# Altium schematic sheet TI_92_adc.SchDoc: Data_Input
size B; Organization: Altium Limited; Address1: L3, 12a Rodborough Rd; Address2: Frenchs Forest; Address3: NSW; Address4: Australia 2086; SheetNumber: 3
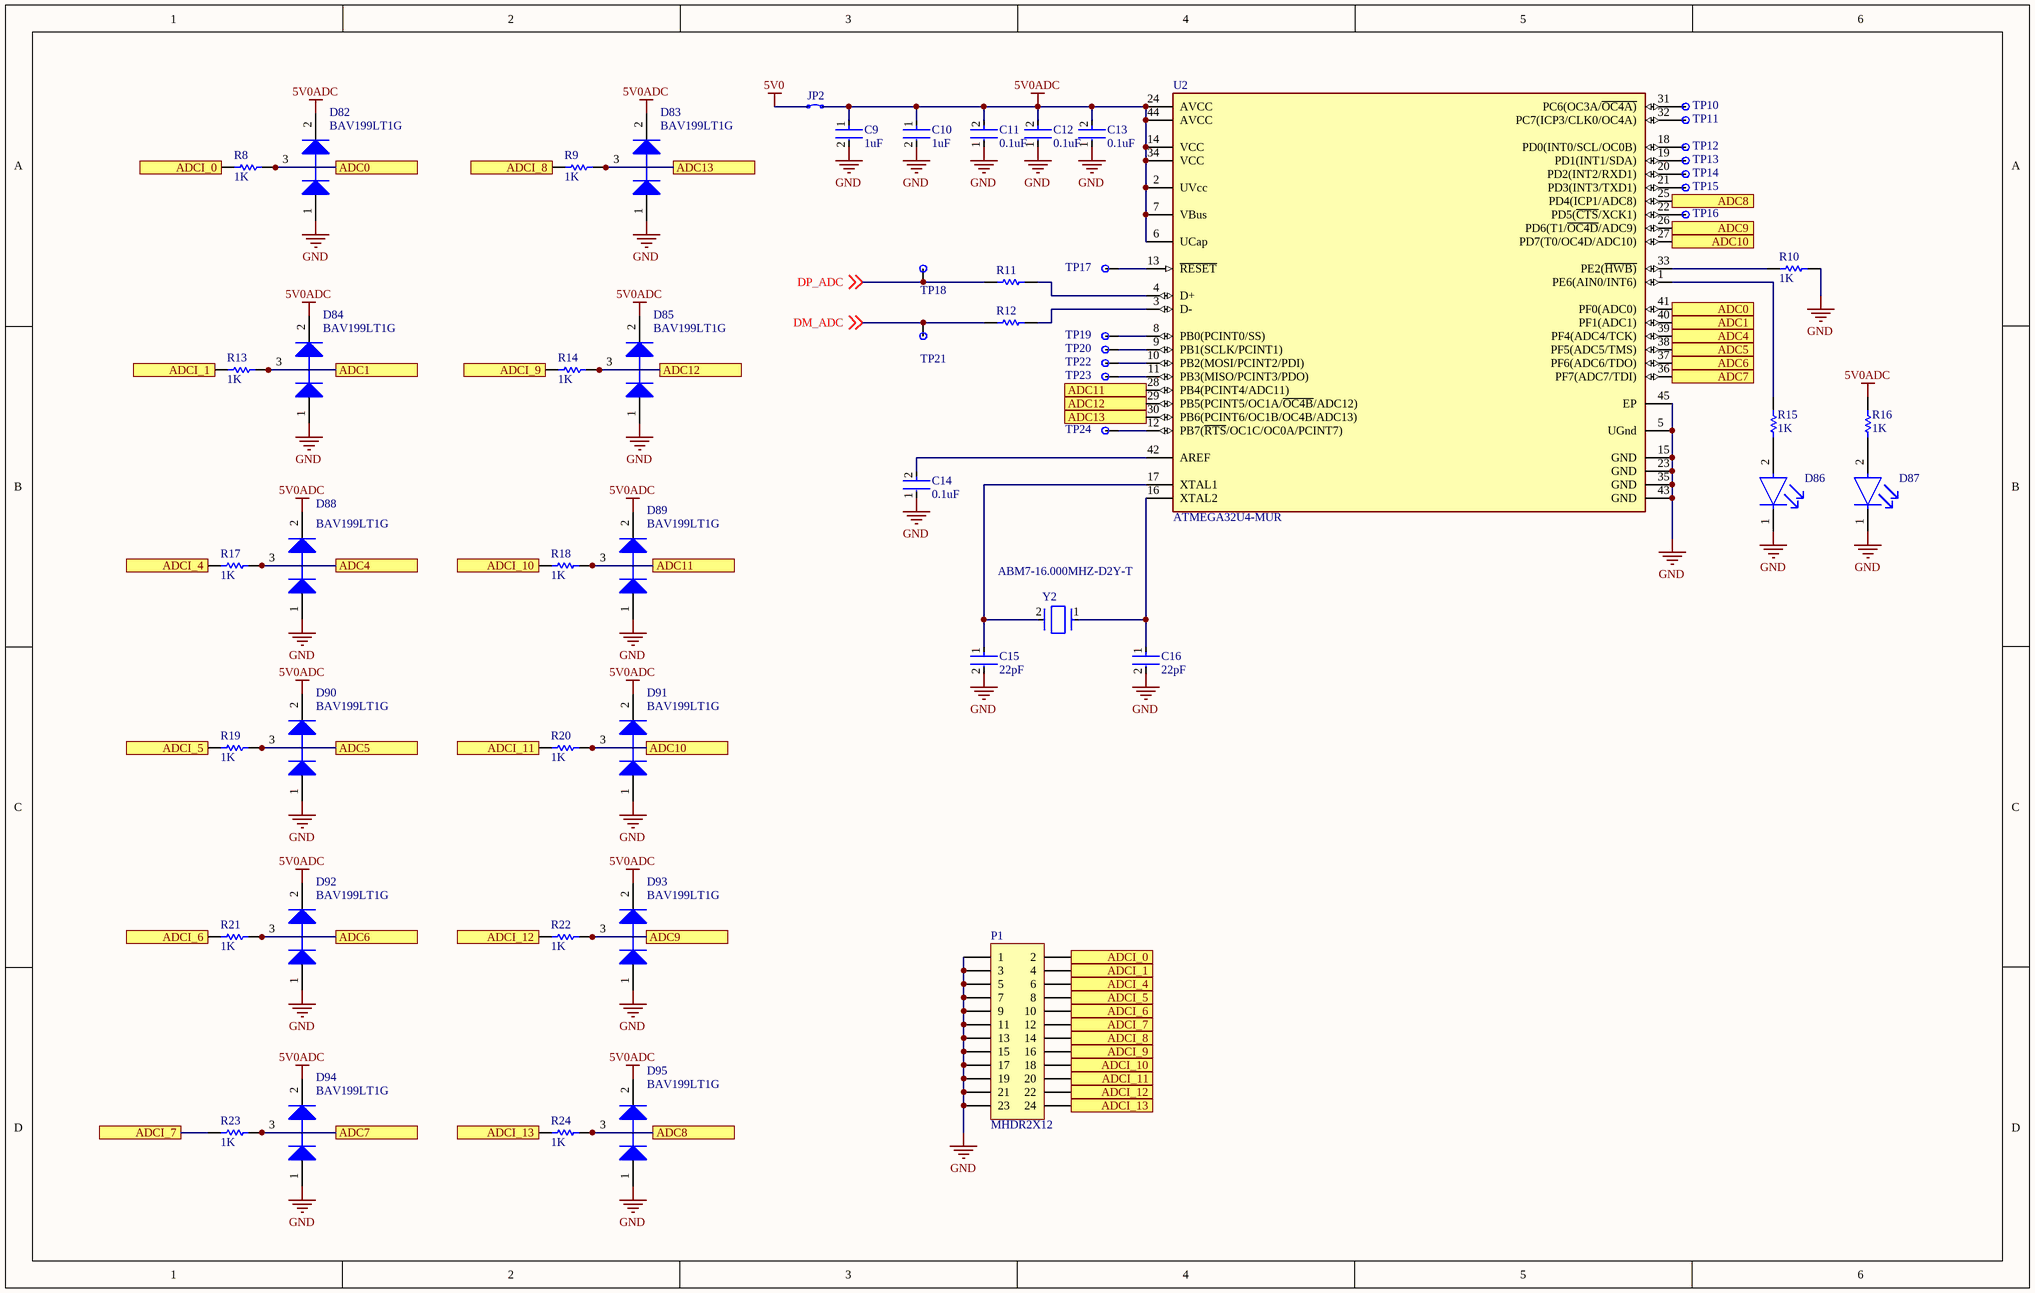
[diagram p0: TI_92_adc.SchDoc]

## Parts
C9  1uF  [FP-C0402C105K8PACTU-MFG]
C10  1uF  [FP-C0402C105K8PACTU-MFG]
C11  0.1uF  [FP-GRM15-MFG]
C12  0.1uF  [FP-GRM15-MFG]
C13  0.1uF  [FP-GRM15-MFG]
C14  0.1uF  [FP-GRM15-MFG]
C15  22pF  [FP-0402-L_1_0_1-W_0_5_0_1-MFG]
C16  22pF  [FP-C0402C105K8PACTU-MFG]
D82  BAV199LT1G  [ONSC-SOT-23-3-318-08_V]
D83  BAV199LT1G  [ONSC-SOT-23-3-318-08_V]
D84  BAV199LT1G  [ONSC-SOT-23-3-318-08_V]
D85  BAV199LT1G  [ONSC-SOT-23-3-318-08_V]
D86  APHHS1005CGCK  [FP-APHHS1005CGCK-MFG]  (value not drawn)
D87  APHHS1005CGCK  [FP-APHHS1005CGCK-MFG]  (value not drawn)
D88  BAV199LT1G  [ONSC-SOT-23-3-318-08_V]
D89  BAV199LT1G  [ONSC-SOT-23-3-318-08_V]
D90  BAV199LT1G  [ONSC-SOT-23-3-318-08_V]
D91  BAV199LT1G  [ONSC-SOT-23-3-318-08_V]
D92  BAV199LT1G  [ONSC-SOT-23-3-318-08_V]
D93  BAV199LT1G  [ONSC-SOT-23-3-318-08_V]
D94  BAV199LT1G  [ONSC-SOT-23-3-318-08_V]
D95  BAV199LT1G  [ONSC-SOT-23-3-318-08_V]
JP2  Solder Jumper  [SOLDER_JUMPER_CLOSED]  (value not drawn)
P1  MHDR2X12  [24_pin_Right_Angle_SMT_Header]
R8  1K  [RESC1005X40X25NL05T10]
R9  1K  [RESC1005X40X25NL05T10]
R10  1K  [RESC1005X40X25LL05T05]
R11  CRCW040222R0FKED  [RESC1005X40X25LL05T05]  (value not drawn)
R12  CRCW040222R0FKED  [RESC1005X40X25LL05T05]  (value not drawn)
R13  1K  [RESC1005X40X25NL05T10]
R14  1K  [RESC1005X40X25NL05T10]
R15  1K  [RESC1005X40X25NL05T10]
R16  1K  [RESC1005X40X25NL05T10]
R17  1K  [RESC1005X40X25NL05T10]
R18  1K  [RESC1005X40X25NL05T10]
R19  1K  [RESC1005X40X25NL05T10]
R20  1K  [RESC1005X40X25NL05T10]
R21  1K  [RESC1005X40X25NL05T10]
R22  1K  [RESC1005X40X25NL05T10]
R23  1K  [RESC1005X40X25NL05T10]
R24  1K  [RESC1005X40X25NL05T10]
TP10  Test Pad  [1.0mm_Pad]  (value not drawn)
TP11  Test Pad  [1.0mm_Pad]  (value not drawn)
TP12  Test Pad  [1.5MM_PAD]  (value not drawn)
TP13  Test Pad  [1.5MM_PAD]  (value not drawn)
TP14  Test Pad  [1.5MM_PAD]  (value not drawn)
TP15  Test Pad  [1.5MM_PAD]  (value not drawn)
TP16  Test Pad  [1.5MM_PAD]  (value not drawn)
TP17  Test Pad  [1.5MM_PAD]  (value not drawn)
TP18  Test Pad  [1.5MM_PAD]  (value not drawn)
TP19  Test Pad  [1.5MM_PAD]  (value not drawn)
TP20  Test Pad  [1.5MM_PAD]  (value not drawn)
TP21  Test Pad  [1.5MM_PAD]  (value not drawn)
TP22  Test Pad  [1.5MM_PAD]  (value not drawn)
TP23  Test Pad  [1.5MM_PAD]  (value not drawn)
TP24  Test Pad  [1.5MM_PAD]  (value not drawn)
U2  ATMEGA32U4-MUR  [FP-44PW-MFG]
Y2  ABM7-16.000MHZ-D2Y-T  [FP-ABM7-MFG]

## Ports
ADC0, ADC1, ADC4, ADC5, ADC6, ADC7, ADC8, ADC9, ADC10, ADC11, ADC12, ADC13, ADCI_0, ADCI_1, ADCI_4, ADCI_5, ADCI_6, ADCI_7, ADCI_8, ADCI_9, ADCI_10, ADCI_11, ADCI_12, ADCI_13

## Nets
5V0: JP2.1
5V0ADC: C9.1 C10.1 C11.2 C12.2 C13.2 D82.2(K) D83.2(K) D84.2(K) D85.2(K) D88.2(K) D89.2(K) D90.2(K) D91.2(K) D92.2(K) D93.2(K) D94.2(K) D95.2(K) JP2.2 R16.2 U2.2(UVcc) U2.6(UCap) U2.7(VBus) U2.14(VCC) U2.24(AVCC) U2.34(VCC) U2.44(AVCC)
GND: C9.2 C10.2 C11.1 C12.1 C13.1 C14.1 C15.2 C16.2 D82.1(A) D83.1(A) D84.1(A) D85.1(A) D86.1(C) D87.1(C) D88.1(A) D89.1(A) D90.1(A) D91.1(A) D92.1(A) D93.1(A) D94.1(A) D95.1(A) P1.1 P1.3 P1.5 P1.7 P1.9 P1.11 P1.13 P1.15 P1.17 P1.19 P1.21 P1.23 R10.2 U2.5(UGnd) U2.15(GND) U2.23(GND) U2.35(GND) U2.43(GND) U2.45(EP)
ADC0: D82.3(K/A) R8.1 U2.41(PF0(ADC0)) ; port ADC0
ADC1: D84.3(K/A) R13.1 U2.40(PF1(ADC1)) ; port ADC1
ADC4: D88.3(K/A) R17.1 U2.39(PF4(ADC4/TCK)) ; port ADC4
ADC5: D90.3(K/A) R19.1 U2.38(PF5(ADC5/TMS)) ; port ADC5
ADC6: D92.3(K/A) R21.1 U2.37(PF6(ADC6/TDO)) ; port ADC6
ADC7: D94.3(K/A) R23.1 U2.36(PF7(ADC7/TDI)) ; port ADC7
ADC8: D95.3(K/A) R24.1 U2.25(PD4(ICP1/ADC8)) ; port ADC8
ADC9: D93.3(K/A) R22.1 U2.26(PD6(T1/~{OC4D}/ADC9)) ; port ADC9
ADC10: D91.3(K/A) R20.1 U2.27(PD7(T0/OC4D/ADC10)) ; port ADC10
ADC11: D89.3(K/A) R18.1 U2.28(PB4(PCINT4/ADC11)) ; port ADC11
ADC12: D85.3(K/A) R14.1 U2.29(PB5(PCINT5/OC1A/~{OC4B}/ADC12)) ; port ADC12
ADC13: D83.3(K/A) R9.1 U2.30(PB6(PCINT6/OC1B/OC4B/ADC13)) ; port ADC13
ADCI_0: P1.2 R8.2 ; port ADCI_0
ADCI_1: P1.4 R13.2 ; port ADCI_1
ADCI_4: P1.6 R17.2 ; port ADCI_4
ADCI_5: P1.8 R19.2 ; port ADCI_5
ADCI_6: P1.10 R21.2 ; port ADCI_6
ADCI_7: P1.12 R23.2 ; port ADCI_7
ADCI_8: P1.14 R9.2 ; port ADCI_8
ADCI_9: P1.16 R14.2 ; port ADCI_9
ADCI_10: P1.18 R18.2 ; port ADCI_10
ADCI_11: P1.20 R20.2 ; port ADCI_11
ADCI_12: P1.22 R22.2 ; port ADCI_12
ADCI_13: P1.24 R24.2 ; port ADCI_13
DM_ADC: R12.1 TP21.1(PAD) ; off-sheet DM_ADC
DP_ADC: R11.1 TP18.1(PAD) ; off-sheet DP_ADC
NetC14_2: C14.2 U2.42(AREF)
NetC15_1: C15.1 U2.17(XTAL1) Y2.2
NetC16_1: C16.1 U2.16(XTAL2) Y2.1
NetD86_2: D86.2(A) R15.1
NetD87_2: D87.2(A) R16.1
NetR10_1: R10.1 U2.33(PE2(~{HWB)})
NetR11_2: R11.2 U2.4(D+)
NetR12_2: R12.2 U2.3(D-)
NetR15_2: R15.2 U2.1(PE6(AIN0/INT6))
NetTP10_1: TP10.1(PAD) U2.31(PC6(OC3A/~{OC4A)})
NetTP11_1: TP11.1(PAD) U2.32(PC7(ICP3/CLK0/OC4A))
NetTP12_1: TP12.1(PAD) U2.18(PD0(INT0/SCL/OC0B))
NetTP13_1: TP13.1(PAD) U2.19(PD1(INT1/SDA))
NetTP14_1: TP14.1(PAD) U2.20(PD2(INT2/RXD1))
NetTP15_1: TP15.1(PAD) U2.21(PD3(INT3/TXD1))
NetTP16_1: TP16.1(PAD) U2.22(PD5(~{CTS}/XCK1))
NetTP17_1: TP17.1(PAD) U2.13(~{RESET})
NetTP19_1: TP19.1(PAD) U2.8(PB0(PCINT0/SS))
NetTP20_1: TP20.1(PAD) U2.9(PB1(SCLK/PCINT1))
NetTP22_1: TP22.1(PAD) U2.10(PB2(MOSI/PCINT2/PDI))
NetTP23_1: TP23.1(PAD) U2.11(PB3(MISO/PCINT3/PDO))
NetTP24_1: TP24.1(PAD) U2.12(PB7(~{RTS}/OC1C/OC0A/PCINT7))

## Notes on the sheet
- Title
- Size:
- Date:
- File:
- C
- Number:
- Time:
- Revision:
- Sheet
- of

## Library data of the parts
C9 C10 C16 = CMP-2008-02081-2: CAP CER 1UF 10V X5R 0402; Dielectric Material: Ceramic; Dissipation Factor: 5%; Tolerance: 10%; Number of Pins: 2; Contact Plating: Tin; Min Operating Temperature: -55°C; Termination: SMD/SMT; Lead Free: Lead Free; Construction: Flat; Voltage Rating (DC): 10V; Mount: Surface Mount; Series: C; Thickness: 0.022inch; Width: 0.5mm; Radiation Hardening: No; Capacitance: 1uF; Dielectric: X5R; Height: 0.5mm; Voltage: 10V; Length: 1mm; Depth: 0.5mm; Max Operating Temperature: 85°C; Package Quantity: 1; Packaging: Tape and Reel; RoHS Compliant: Yes; Case Code (Imperial): 0402; Case Code (Metric): 1005; REACH SVHC: No SVHC; Voltage Rating: 10V; Case/Package: 0402
C11-C14 = CMP-2100-03641-2: CAP CER 0.1UF 16V X7R 0402; Manufacturer Part Number: GRM155R71C104KA88D; Manufacturer: Murata; Standoff Height: 0mm; Tolerance: 10%; Voltage Rating: 16Vdc; Material: Ceramic; Capacitance: 0.10μF; Value: 0.10μF; RoHS: TRUE; Temperature Characteristic: X7R; Octopart: https://octopart.com/grm155r71c104ka88d-murata-196880; Digikey Description: CAP CER 0.1UF 16V X7R 0402; Device Class L3: Ceramic Capacitors; Height: 0.55mm; ComponentLink2Description: Datasheet; Temperature Range Low: -55°C; Ipc Land Pattern Name: CAPC10050X219; ComponentLink2URL: https://search.murata.co.jp/Ceramy/image/img/A01X/G101/ENG/GRM155R71H471KA01-01A.pdf; Device Class L1: Passive Components; Lead Free: yes; Category: Cap; Package: GRM15; Temperature: -55°C to +125°C; Device Class L2: Capacitors; Temperature Range High: +125°C; Mouser Description: 0402 0.1 uF 16V ±10 % Tolerance X7R SMT Multilayer Ceramic Capacitor
C15 = CMP-2008-02613-2: General Purpose Ceramic Capacitor, 0402, 22pF, 5%, C0G, 30ppm/°C, 50V; Temperature Coefficient: 30ppm/°C; Mount: Surface Mount; Length: 1mm; Construction: Flat; Contact Plating: Tin; REACH SVHC: No SVHC; Case/Package: 0402; Voltage: 50V; Case Code (Imperial): 0402; Thickness: 0.022inch; Radiation Hardening: No; Number of Pins: 2; Tolerance: 5%; Max Operating Temperature: 125°C; RoHS Compliant: Yes; Voltage Rating: 50V; Case Code (Metric): 1005; Package Quantity: 1; Width: 0.02inch; Termination: SMD/SMT; Lead Free: Lead Free; Height: 0.5mm; Voltage Rating (DC): 50V; Capacitance: 22pF; Min Operating Temperature: -55°C; Series: -; Depth: 0.5mm; Dielectric: C0G; Packaging: Tape and Reel
D82-D85 D88-D95 = CMP-1054-00087-1: Dual Series Switching Diodes, 3-Pin SOT-23, Pb-Free, Tape and Reel; Manufacturer: On Semiconductor; IF Max (A): 0.215; trr Max (ns): 3000; PartNumber: BAV199LT1G; RoHS: TRUE; ComponentLink1Description: Manufacturer URL; ComponentLink2URL: http://www.onsemi.com/pub_link/Collateral/BAV199LT1-D.PDF; Mounting Technology: Surface Mount; ComponentLink2Description: Datasheet; ComponentLink3Description: Package Specification; PackageReference: SOT-23-3-318-08; PackageVersion: Rev. AP, 11/2009; Packing: Tape and Reel; DatasheetVersion: Rev. 8; Configuration: Dual Series; ComponentLink1URL: http://www.onsemi.com/; ComponentLink3URL: http://www.onsemi.cn/pub_link/Collateral/318-08.PDF; PackageDescription: 3-Pin Small Outline Transistor, Body 2.92 x 1.3 mm, Pitch 0.95 mm
D86 D87 = CMP-44529-000044-1: LED GREEN CLEAR CHIP SMD; Viewing Angle: 120°; Dominant Wavelength: 570nm; Test Current: 20mA; Luminous Intensity: 50mcd; Forward Voltage: 2.1V; Number of LEDs: 1; Lens Color: Clear; Packaging: Tape and Reel; Max Operating Temperature: 85°C; Illumination Color: Green; Length: 1mm; Mount: Surface Mount; Lens Style: Clear; Color: Green; Number of Pins: 2; Wavelength: 570nm; Case/Package: 0402; Width: 0.5mm; Package Quantity: 2000; Case Code (Metric): 1005; Height: 0.6mm; Lead Free: Lead Free; Case Code (Imperial): 0402; Forward Current: 20mA; Min Operating Temperature: -40°C
JP2 = Solder_Jumper: Solder Jumpers, open and closed
P1 = MHDR2X12: Header, 12-Pin, Dual row; LatestRevisionDate: 17-Jul-2002; LatestRevisionNote: Re-released for DXP Platform.; Publisher: Altium Limited
R8 R9 R13-R24 = CMP-2002-07472-1: Part Number: RC0402FR-071KL; Manufacturer: Yageo / Phycomp
R10 = CMP-2002-08382-1: Manufacturer: Vishay Dale; Part Number: CRCW040222R0FKED
R11 R12 = CMP-2002-08382-1: Manufacturer: Vishay Dale; Part Number: CRCW040222R0FKED
TP10-TP24 = Test_Pad: Various Test Pads
U2 = CMP-06276-000039-1: IC MCU 8BIT 32KB FLASH 44VQFN; Oscillator Type: Internal; Interface: I2C; Core Architecture: PIC; Number of I/Os: 21; Peripherals: Brown-out Detect/Reset; Packaging: Rail/Tube; Memory Size: 32KB; Memory Type: FLASH; Case/Package: SOIC; Max Operating Temperature: 125°C; Min Operating Temperature: -40°C
Y2 = CMP-27762-000095-1: Crystal 16MHz ±20ppm 18pF SMD-2 6mm x 3.5mm; ESR (Equivalent Series Resistance): 50R; Frequency Stability: 30ppm; Width: 3.3mm; Frequency: 16MHz; Radiation Hardening: No; Height: 0.055inch; Tolerance: 20ppm; Length: 6mm; Case/Package: CSMD; Lead Free: Lead Free; Min Operating Temperature: -40°C; Termination: SMD/SMT; Operating Frequency: 16 MHz; Resistor Type: Ceramic; Packaging: Tape and Reel; Mount: Surface Mount; Load Capacitance: 18pF; Frequency Tolerance: 20ppm; Depth: 3.5mm; Series: ABM7; Package Quantity: 1000; Max Operating Temperature: 85°C; Number of Pins: 2